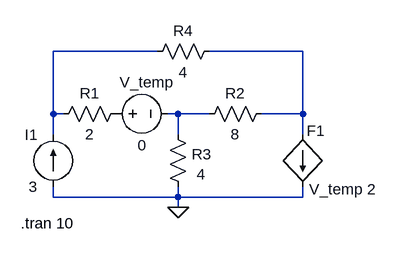
[diagram p0: schematic Q3.asc]
Q3.asc, the LTspice schematic file:
Version 4
SHEET 1 880 680
WIRE 128 16 -32 16
WIRE 352 16 208 16
WIRE -32 112 -32 16
WIRE -16 112 -32 112
WIRE 160 112 144 112
WIRE 208 112 160 112
WIRE 352 112 352 16
WIRE 352 112 288 112
WIRE -32 144 -32 112
WIRE 160 144 160 112
WIRE 352 144 352 112
WIRE -32 240 -32 224
WIRE 160 240 160 224
WIRE 160 240 -32 240
WIRE 352 240 352 224
WIRE 352 240 160 240
WIRE 160 256 160 240
FLAG 160 256 0
SYMBOL res 80 96 R90
WINDOW 0 0 56 VBottom 2
WINDOW 3 32 56 VTop 2
SYMATTR InstName R1
SYMATTR Value 2
SYMBOL res 304 96 R90
WINDOW 0 0 56 VBottom 2
WINDOW 3 32 56 VTop 2
SYMATTR InstName R2
SYMATTR Value 8
SYMBOL res 176 240 R180
WINDOW 0 -36 66 Left 2
WINDOW 3 -26 35 Left 2
SYMATTR InstName R3
SYMATTR Value 4
SYMBOL res 112 32 R270
WINDOW 0 32 56 VTop 2
WINDOW 3 0 56 VBottom 2
SYMATTR InstName R4
SYMATTR Value 4
SYMBOL current -32 224 R180
WINDOW 0 24 80 Left 2
WINDOW 3 24 0 Left 2
WINDOW 123 0 0 Left 0
WINDOW 39 0 0 Left 0
SYMATTR InstName I1
SYMATTR Value 3
SYMBOL f 352 144 R0
WINDOW 0 6 -6 Left 2
WINDOW 3 10 84 Left 2
SYMATTR InstName F1
SYMATTR Value V_temp 2
SYMBOL voltage 48 112 R270
WINDOW 0 33 64 VTop 2
WINDOW 3 -33 57 VBottom 2
WINDOW 123 0 0 Left 0
WINDOW 39 0 0 Left 0
SYMATTR InstName V_temp
SYMATTR Value 0
TEXT -82 280 Left 2 !.tran 10

The netlist it stands for:
* Q3.asc
R1 P001 N001 2
R2 N002 N003 8
R3 0 N003 4
R4 N001 N002 4
I1 0 N001 3
F1 N002 0 V_temp 2
V_temp P001 N003 0
.tran 10
.backanno
.end